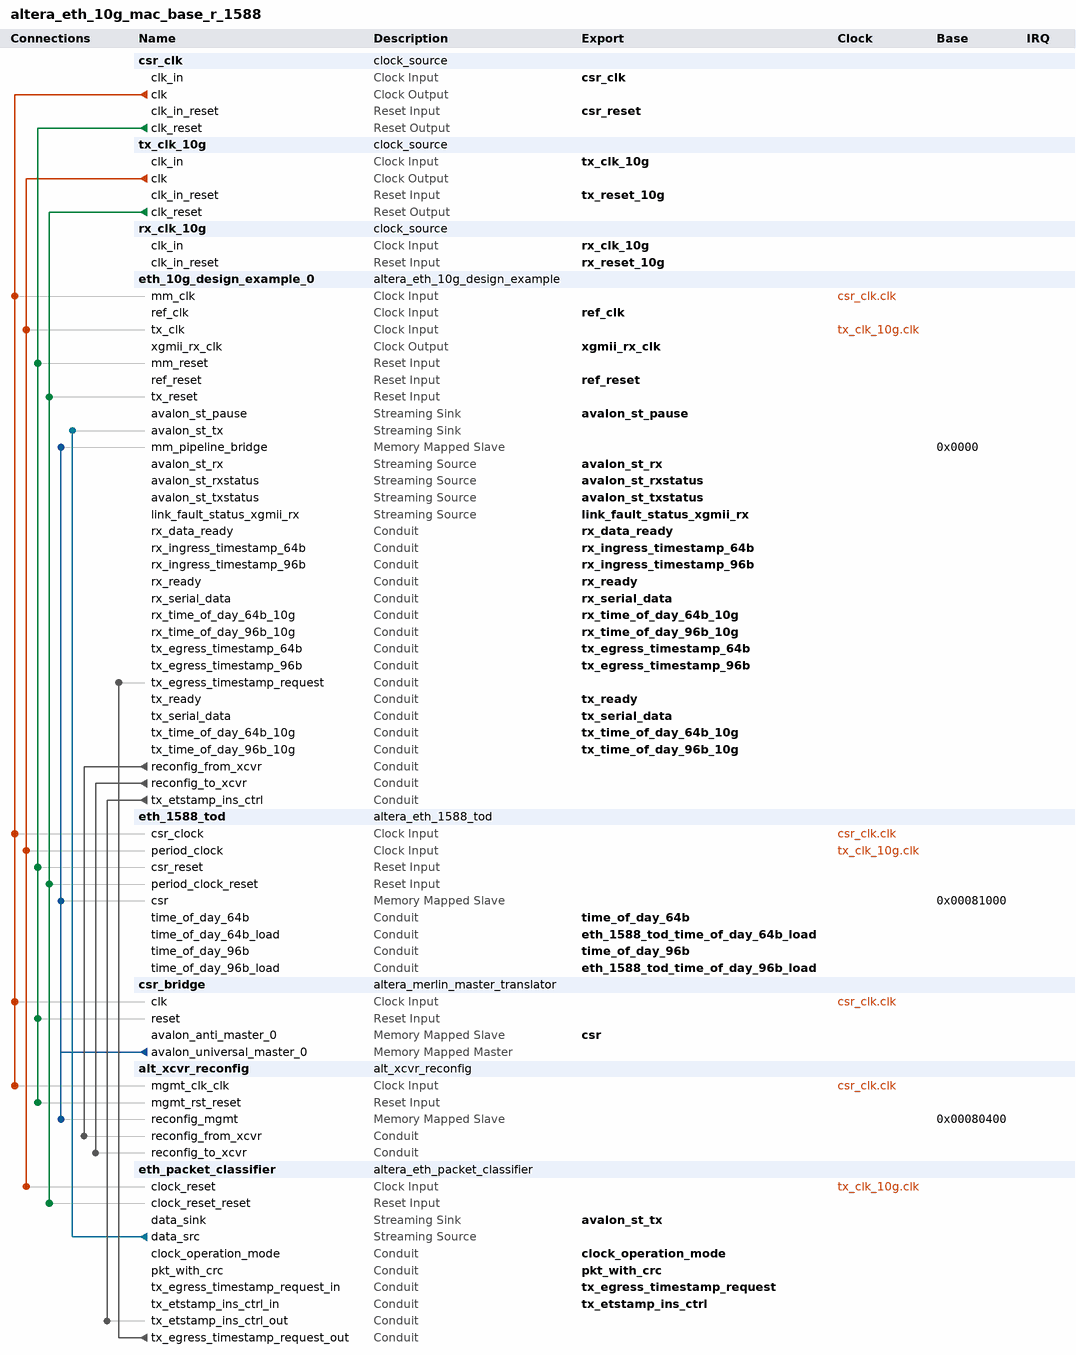
[diagram p0: system contents]
# Platform Designer (Qsys) system altera_eth_10g_mac_base_r_1588, Stratix V Unknown
# Parameters at their usual value, and those the tool derives, are not listed.
package require -exact qsys 13.0
create_system altera_eth_10g_mac_base_r_1588
set_project_property DEVICE_FAMILY {Stratix V}
set_project_property DEVICE Unknown

add_instance csr_clk clock_source 13.0
set_instance_parameter_value csr_clk clockFrequency 50000000

add_instance tx_clk_10g clock_source 13.0
set_instance_parameter_value tx_clk_10g clockFrequency 50000000

add_instance rx_clk_10g clock_source 13.0
set_instance_parameter_value rx_clk_10g clockFrequency 50000000

add_instance eth_10g_design_example_0 altera_eth_10g_design_example 13.0
set_instance_parameter_value eth_10g_design_example_0 DEVICE_FAMILY_TOP {Stratix V}
set_instance_parameter_value eth_10g_design_example_0 ENABLE_MAC_LOOPBACK {10Gbps Ethernet MAC with LoopBack Enabled}
set_instance_parameter_value eth_10g_design_example_0 CHOOSE_MDIO_2_WIRE_SERIAL_INT 1
set_instance_parameter_value eth_10g_design_example_0 PHY_IP 1
set_instance_parameter_value eth_10g_design_example_0 CHOOSE_FIFO 3
set_instance_parameter_value eth_10g_design_example_0 ENABLE_TIMESTAMPING 1
set_instance_parameter_value eth_10g_design_example_0 ENABLE_PTP_1STEP 1
set_instance_parameter_value eth_10g_design_example_0 TSTAMP_FP_WIDTH 4
set_instance_parameter_value eth_10g_design_example_0 PREAMBLE_PASSTHROUGH 0
set_instance_parameter_value eth_10g_design_example_0 ENABLE_PFC 0
set_instance_parameter_value eth_10g_design_example_0 PFC_PRIORITY_NUM 8
set_instance_parameter_value eth_10g_design_example_0 DATAPATH_OPTION 3
set_instance_parameter_value eth_10g_design_example_0 ENABLE_SUPP_ADDR 1
set_instance_parameter_value eth_10g_design_example_0 INSTANTIATE_TX_CRC 1
set_instance_parameter_value eth_10g_design_example_0 INSTANTIATE_STATISTICS 1
set_instance_parameter_value eth_10g_design_example_0 REGISTER_BASED_STATISTICS 0
set_instance_parameter_value eth_10g_design_example_0 ENABLE_1G10G_MAC 0
set_instance_parameter_value eth_10g_design_example_0 MDIO_MDC_DIVISOR 32
set_instance_parameter_value eth_10g_design_example_0 SYNC_TX_FIFO_SYMBOLS_PER_BEAT 8
set_instance_parameter_value eth_10g_design_example_0 SYNC_TX_FIFO_BITS_PER_SYMBOL 8
set_instance_parameter_value eth_10g_design_example_0 SYNC_TX_FIFO_DEPTH 512
set_instance_parameter_value eth_10g_design_example_0 SYNC_TX_FIFO_ERROR_WIDTH 1
set_instance_parameter_value eth_10g_design_example_0 SYNC_TX_USE_PACKETS 1
set_instance_parameter_value eth_10g_design_example_0 SYNC_TX_USE_FILL 1
set_instance_parameter_value eth_10g_design_example_0 SYNC_TX_USE_STORE_AND_FORWARD 1
set_instance_parameter_value eth_10g_design_example_0 SYNC_TX_USE_ALMOST_FULL 0
set_instance_parameter_value eth_10g_design_example_0 SYNC_TX_USE_ALMOST_EMPTY 0
set_instance_parameter_value eth_10g_design_example_0 SYNC_RX_FIFO_SYMBOLS_PER_BEAT 8
set_instance_parameter_value eth_10g_design_example_0 SYNC_RX_FIFO_BITS_PER_SYMBOL 8
set_instance_parameter_value eth_10g_design_example_0 SYNC_RX_FIFO_DEPTH 512
set_instance_parameter_value eth_10g_design_example_0 SYNC_RX_FIFO_ERROR_WIDTH 6
set_instance_parameter_value eth_10g_design_example_0 SYNC_RX_USE_PACKETS 1
set_instance_parameter_value eth_10g_design_example_0 SYNC_RX_USE_FILL 1
set_instance_parameter_value eth_10g_design_example_0 SYNC_RX_USE_STORE_AND_FORWARD 1
set_instance_parameter_value eth_10g_design_example_0 SYNC_RX_USE_ALMOST_FULL 1
set_instance_parameter_value eth_10g_design_example_0 SYNC_RX_USE_ALMOST_EMPTY 1
set_instance_parameter_value eth_10g_design_example_0 ASYNC_TX_FIFO_SYMBOLS_PER_BEAT 8
set_instance_parameter_value eth_10g_design_example_0 ASYNC_TX_FIFO_BITS_PER_SYMBOL 8
set_instance_parameter_value eth_10g_design_example_0 ASYNC_TX_FIFO_DEPTH 16
set_instance_parameter_value eth_10g_design_example_0 ASYNC_TX_FIFO_ERROR_WIDTH 1
set_instance_parameter_value eth_10g_design_example_0 ASYNC_TX_USE_PKT 1
set_instance_parameter_value eth_10g_design_example_0 ASYNC_TX_USE_SINK_FILL 0
set_instance_parameter_value eth_10g_design_example_0 ASYNC_TX_USE_SRC_FILL 0
set_instance_parameter_value eth_10g_design_example_0 ASYNC_RX_FIFO_SYMBOLS_PER_BEAT 8
set_instance_parameter_value eth_10g_design_example_0 ASYNC_RX_FIFO_BITS_PER_SYMBOL 8
set_instance_parameter_value eth_10g_design_example_0 ASYNC_RX_FIFO_DEPTH 16
set_instance_parameter_value eth_10g_design_example_0 ASYNC_RX_FIFO_ERROR_WIDTH 6
set_instance_parameter_value eth_10g_design_example_0 ASYNC_RX_USE_PKT 1
set_instance_parameter_value eth_10g_design_example_0 ASYNC_RX_USE_SINK_FILL 0
set_instance_parameter_value eth_10g_design_example_0 ASYNC_RX_USE_SRC_FILL 0
set_instance_parameter_value eth_10g_design_example_0 BASER_INTERFACE 0
set_instance_parameter_value eth_10g_design_example_0 BASER_PLL_TYPE CMU
set_instance_parameter_value eth_10g_design_example_0 BASER_STARTING_CHANNEL_NUMBER 0
set_instance_parameter_value eth_10g_design_example_0 BASER_REF_CLK_FREQ {644.53125 MHz}
set_instance_parameter_value eth_10g_design_example_0 BASER_TRANSMITTER_TERMINATION OCT_100_OHMS
set_instance_parameter_value eth_10g_design_example_0 BASER_PRE_EMPHASIS_PRE_TAP 0
set_instance_parameter_value eth_10g_design_example_0 BASER_PRE_EMPHASIS_PRE_TAP_POLARITY 0
set_instance_parameter_value eth_10g_design_example_0 BASER_PRE_EMPHASIS_FIRST_POST_TAP 5
set_instance_parameter_value eth_10g_design_example_0 BASER_PRE_EMPHASIS_SECOND_POST_TAP 0
set_instance_parameter_value eth_10g_design_example_0 BASER_PRE_EMPHASIS_SECOND_POST_TAP_POLARITY 0
set_instance_parameter_value eth_10g_design_example_0 BASER_TRANSMITTER_VOD 1
set_instance_parameter_value eth_10g_design_example_0 BASER_RECEIVER_TERMINATION OCT_100_OHMS
set_instance_parameter_value eth_10g_design_example_0 BASER_RECEIVER_DC_GAIN 0
set_instance_parameter_value eth_10g_design_example_0 BASER_RECEIVER_STATIC_EQUALIZER 14
set_instance_parameter_value eth_10g_design_example_0 BASER_EXT_PMA_CONTROL_CONF 0
set_instance_parameter_value eth_10g_design_example_0 BASER_ENA_ADD_CONTROL_STAT 0
set_instance_parameter_value eth_10g_design_example_0 BASER_RECOVERED_CLK_OUT 0
set_instance_parameter_value eth_10g_design_example_0 XAUI_STARTING_CHANNEL_NUMBER 0
set_instance_parameter_value eth_10g_design_example_0 starting_channel_number 0
set_instance_parameter_value eth_10g_design_example_0 interface_type {Soft XAUI}
set_instance_parameter_value eth_10g_design_example_0 soft_xaui_cfg {Only Soft XAUI is supported for this device.}
set_instance_parameter_value eth_10g_design_example_0 hard_xaui_cfg {Only Hard XAUI is supported for this device.}
set_instance_parameter_value eth_10g_design_example_0 gui_pll_type CMU
set_instance_parameter_value eth_10g_design_example_0 use_control_and_status_ports 0
set_instance_parameter_value eth_10g_design_example_0 external_pma_ctrl_reconf 0
set_instance_parameter_value eth_10g_design_example_0 recovered_clk_out 0
set_instance_parameter_value eth_10g_design_example_0 number_of_interfaces 1
set_instance_parameter_value eth_10g_design_example_0 use_rx_rate_match 0
set_instance_parameter_value eth_10g_design_example_0 tx_termination OCT_100_OHMS
set_instance_parameter_value eth_10g_design_example_0 tx_vod_selection 4
set_instance_parameter_value eth_10g_design_example_0 tx_preemp_pretap 0
set_instance_parameter_value eth_10g_design_example_0 tx_preemp_pretap_inv false
set_instance_parameter_value eth_10g_design_example_0 tx_preemp_tap_1 0
set_instance_parameter_value eth_10g_design_example_0 tx_preemp_tap_2 0
set_instance_parameter_value eth_10g_design_example_0 tx_preemp_tap_2_inv false
set_instance_parameter_value eth_10g_design_example_0 rx_common_mode 0.82v
set_instance_parameter_value eth_10g_design_example_0 rx_termination OCT_100_OHMS
set_instance_parameter_value eth_10g_design_example_0 rx_eq_dc_gain 0
set_instance_parameter_value eth_10g_design_example_0 rx_eq_ctrl 0

add_instance eth_1588_tod altera_eth_1588_tod 13.0
set_instance_parameter_value eth_1588_tod DEFAULT_NSEC_PERIOD 6
set_instance_parameter_value eth_1588_tod DEFAULT_FNSEC_PERIOD 26214
set_instance_parameter_value eth_1588_tod DEFAULT_NSEC_ADJPERIOD 6
set_instance_parameter_value eth_1588_tod DEFAULT_FNSEC_ADJPERIOD 26214

add_instance csr_bridge altera_merlin_master_translator 13.0
set_instance_parameter_value csr_bridge AV_ADDRESS_W 32
set_instance_parameter_value csr_bridge AV_DATA_W 32
set_instance_parameter_value csr_bridge AV_BURSTCOUNT_W 3
set_instance_parameter_value csr_bridge AV_BYTEENABLE_W 4
set_instance_parameter_value csr_bridge UAV_ADDRESS_W 32
set_instance_parameter_value csr_bridge UAV_BURSTCOUNT_W 3
set_instance_parameter_value csr_bridge AV_READLATENCY 0
set_instance_parameter_value csr_bridge AV_WRITE_WAIT 0
set_instance_parameter_value csr_bridge AV_READ_WAIT 0
set_instance_parameter_value csr_bridge AV_DATA_HOLD 0
set_instance_parameter_value csr_bridge AV_SETUP_WAIT 0
set_instance_parameter_value csr_bridge USE_READDATA 1
set_instance_parameter_value csr_bridge USE_WRITEDATA 1
set_instance_parameter_value csr_bridge USE_READ 1
set_instance_parameter_value csr_bridge USE_WRITE 1
set_instance_parameter_value csr_bridge USE_BEGINBURSTTRANSFER 0
set_instance_parameter_value csr_bridge USE_BEGINTRANSFER 0
set_instance_parameter_value csr_bridge USE_BYTEENABLE 0
set_instance_parameter_value csr_bridge USE_CHIPSELECT 0
set_instance_parameter_value csr_bridge USE_ADDRESS 1
set_instance_parameter_value csr_bridge USE_BURSTCOUNT 0
set_instance_parameter_value csr_bridge USE_DEBUGACCESS 0
set_instance_parameter_value csr_bridge USE_CLKEN 0
set_instance_parameter_value csr_bridge USE_READDATAVALID 0
set_instance_parameter_value csr_bridge USE_WAITREQUEST 1
set_instance_parameter_value csr_bridge USE_LOCK 0
set_instance_parameter_value csr_bridge USE_READRESPONSE 0
set_instance_parameter_value csr_bridge USE_WRITERESPONSE 0
set_instance_parameter_value csr_bridge AV_SYMBOLS_PER_WORD 4
set_instance_parameter_value csr_bridge AV_ADDRESS_SYMBOLS 1
set_instance_parameter_value csr_bridge AV_BURSTCOUNT_SYMBOLS 1
set_instance_parameter_value csr_bridge AV_CONSTANT_BURST_BEHAVIOR 0
set_instance_parameter_value csr_bridge UAV_CONSTANT_BURST_BEHAVIOR 0
set_instance_parameter_value csr_bridge AV_LINEWRAPBURSTS 0
set_instance_parameter_value csr_bridge AV_MAX_PENDING_READ_TRANSACTIONS 0
set_instance_parameter_value csr_bridge AV_BURSTBOUNDARIES 0
set_instance_parameter_value csr_bridge AV_INTERLEAVEBURSTS 0
set_instance_parameter_value csr_bridge AV_BITS_PER_SYMBOL 8
set_instance_parameter_value csr_bridge AV_ISBIGENDIAN 0
set_instance_parameter_value csr_bridge AV_ADDRESSGROUP 0
set_instance_parameter_value csr_bridge UAV_ADDRESSGROUP 0
set_instance_parameter_value csr_bridge AV_REGISTEROUTGOINGSIGNALS 0
set_instance_parameter_value csr_bridge AV_REGISTERINCOMINGSIGNALS 0
set_instance_parameter_value csr_bridge AV_ALWAYSBURSTMAXBURST 0

add_instance alt_xcvr_reconfig alt_xcvr_reconfig 13.0
set_instance_parameter_value alt_xcvr_reconfig device_family {Stratix V}
set_instance_parameter_value alt_xcvr_reconfig number_of_reconfig_interfaces 2
set_instance_parameter_value alt_xcvr_reconfig enable_analog 1
set_instance_parameter_value alt_xcvr_reconfig enable_adce 0

add_instance eth_packet_classifier altera_eth_packet_classifier 13.0
set_instance_parameter_value eth_packet_classifier TSTAMP_FP_WIDTH 4
set_instance_parameter_value eth_packet_classifier SYMBOLSPERBEAT 8
set_instance_parameter_value eth_packet_classifier BITSPERSYMBOL 8

# connections
add_connection csr_clk.clk alt_xcvr_reconfig.mgmt_clk_clk clock
add_connection csr_clk.clk csr_bridge.clk clock
add_connection csr_clk.clk eth_10g_design_example_0.mm_clk clock
add_connection csr_clk.clk eth_1588_tod.csr_clock clock
add_connection tx_clk_10g.clk eth_10g_design_example_0.tx_clk clock
add_connection tx_clk_10g.clk eth_1588_tod.period_clock clock
add_connection tx_clk_10g.clk eth_packet_classifier.clock_reset clock
add_connection csr_clk.clk_reset alt_xcvr_reconfig.mgmt_rst_reset reset
add_connection csr_clk.clk_reset csr_bridge.reset reset
add_connection csr_clk.clk_reset eth_10g_design_example_0.mm_reset reset
add_connection csr_clk.clk_reset eth_1588_tod.csr_reset reset
add_connection tx_clk_10g.clk_reset eth_10g_design_example_0.tx_reset reset
add_connection tx_clk_10g.clk_reset eth_1588_tod.period_clock_reset reset
add_connection tx_clk_10g.clk_reset eth_packet_classifier.clock_reset_reset reset
add_connection csr_bridge.avalon_universal_master_0 alt_xcvr_reconfig.reconfig_mgmt avalon
set_connection_parameter_value csr_bridge.avalon_universal_master_0/alt_xcvr_reconfig.reconfig_mgmt baseAddress 0x00080400
add_connection csr_bridge.avalon_universal_master_0 eth_10g_design_example_0.mm_pipeline_bridge avalon
set_connection_parameter_value csr_bridge.avalon_universal_master_0/eth_10g_design_example_0.mm_pipeline_bridge baseAddress 0x0000
add_connection csr_bridge.avalon_universal_master_0 eth_1588_tod.csr avalon
set_connection_parameter_value csr_bridge.avalon_universal_master_0/eth_1588_tod.csr baseAddress 0x00081000
add_connection eth_packet_classifier.data_src eth_10g_design_example_0.avalon_st_tx avalon_streaming
add_connection eth_10g_design_example_0.reconfig_from_xcvr alt_xcvr_reconfig.reconfig_from_xcvr conduit
add_connection eth_10g_design_example_0.reconfig_to_xcvr alt_xcvr_reconfig.reconfig_to_xcvr conduit
add_connection eth_10g_design_example_0.tx_etstamp_ins_ctrl eth_packet_classifier.tx_etstamp_ins_ctrl_out conduit
add_connection eth_packet_classifier.tx_egress_timestamp_request_out eth_10g_design_example_0.tx_egress_timestamp_request conduit

# exported interfaces
add_interface ref_clk clock sink
set_interface_property ref_clk EXPORT_OF eth_10g_design_example_0.ref_clk
add_interface ref_reset reset sink
set_interface_property ref_reset EXPORT_OF eth_10g_design_example_0.ref_reset
add_interface avalon_st_rxstatus avalon_streaming source
set_interface_property avalon_st_rxstatus EXPORT_OF eth_10g_design_example_0.avalon_st_rxstatus
add_interface link_fault_status_xgmii_rx avalon_streaming source
set_interface_property link_fault_status_xgmii_rx EXPORT_OF eth_10g_design_example_0.link_fault_status_xgmii_rx
add_interface rx_serial_data conduit end
set_interface_property rx_serial_data EXPORT_OF eth_10g_design_example_0.rx_serial_data
add_interface tx_serial_data conduit end
set_interface_property tx_serial_data EXPORT_OF eth_10g_design_example_0.tx_serial_data
add_interface rx_ready conduit end
set_interface_property rx_ready EXPORT_OF eth_10g_design_example_0.rx_ready
add_interface tx_ready conduit end
set_interface_property tx_ready EXPORT_OF eth_10g_design_example_0.tx_ready
add_interface avalon_st_pause avalon_streaming sink
set_interface_property avalon_st_pause EXPORT_OF eth_10g_design_example_0.avalon_st_pause
add_interface avalon_st_txstatus avalon_streaming source
set_interface_property avalon_st_txstatus EXPORT_OF eth_10g_design_example_0.avalon_st_txstatus
add_interface csr avalon slave
set_interface_property csr EXPORT_OF csr_bridge.avalon_anti_master_0
add_interface tx_clk_10g clock sink
set_interface_property tx_clk_10g EXPORT_OF tx_clk_10g.clk_in
add_interface tx_reset_10g reset sink
set_interface_property tx_reset_10g EXPORT_OF tx_clk_10g.clk_in_reset
add_interface xgmii_rx_clk clock source
set_interface_property xgmii_rx_clk EXPORT_OF eth_10g_design_example_0.xgmii_rx_clk
add_interface rx_data_ready conduit end
set_interface_property rx_data_ready EXPORT_OF eth_10g_design_example_0.rx_data_ready
add_interface tx_egress_timestamp_96b conduit end
set_interface_property tx_egress_timestamp_96b EXPORT_OF eth_10g_design_example_0.tx_egress_timestamp_96b
add_interface tx_egress_timestamp_64b conduit end
set_interface_property tx_egress_timestamp_64b EXPORT_OF eth_10g_design_example_0.tx_egress_timestamp_64b
add_interface rx_ingress_timestamp_96b conduit end
set_interface_property rx_ingress_timestamp_96b EXPORT_OF eth_10g_design_example_0.rx_ingress_timestamp_96b
add_interface rx_ingress_timestamp_64b conduit end
set_interface_property rx_ingress_timestamp_64b EXPORT_OF eth_10g_design_example_0.rx_ingress_timestamp_64b
add_interface csr_clk clock sink
set_interface_property csr_clk EXPORT_OF csr_clk.clk_in
add_interface csr_reset reset sink
set_interface_property csr_reset EXPORT_OF csr_clk.clk_in_reset
add_interface rx_clk_10g clock sink
set_interface_property rx_clk_10g EXPORT_OF rx_clk_10g.clk_in
add_interface rx_reset_10g reset sink
set_interface_property rx_reset_10g EXPORT_OF rx_clk_10g.clk_in_reset
add_interface avalon_st_tx avalon_streaming sink
set_interface_property avalon_st_tx EXPORT_OF eth_packet_classifier.data_sink
add_interface avalon_st_rx avalon_streaming source
set_interface_property avalon_st_rx EXPORT_OF eth_10g_design_example_0.avalon_st_rx
add_interface clock_operation_mode conduit end
set_interface_property clock_operation_mode EXPORT_OF eth_packet_classifier.clock_operation_mode
add_interface pkt_with_crc conduit end
set_interface_property pkt_with_crc EXPORT_OF eth_packet_classifier.pkt_with_crc
add_interface tx_egress_timestamp_request conduit end
set_interface_property tx_egress_timestamp_request EXPORT_OF eth_packet_classifier.tx_egress_timestamp_request_in
add_interface time_of_day_96b conduit end
set_interface_property time_of_day_96b EXPORT_OF eth_1588_tod.time_of_day_96b
add_interface time_of_day_64b conduit end
set_interface_property time_of_day_64b EXPORT_OF eth_1588_tod.time_of_day_64b
add_interface tx_time_of_day_96b_10g conduit end
set_interface_property tx_time_of_day_96b_10g EXPORT_OF eth_10g_design_example_0.tx_time_of_day_96b_10g
add_interface tx_time_of_day_64b_10g conduit end
set_interface_property tx_time_of_day_64b_10g EXPORT_OF eth_10g_design_example_0.tx_time_of_day_64b_10g
add_interface rx_time_of_day_96b_10g conduit end
set_interface_property rx_time_of_day_96b_10g EXPORT_OF eth_10g_design_example_0.rx_time_of_day_96b_10g
add_interface rx_time_of_day_64b_10g conduit end
set_interface_property rx_time_of_day_64b_10g EXPORT_OF eth_10g_design_example_0.rx_time_of_day_64b_10g
add_interface tx_etstamp_ins_ctrl conduit end
set_interface_property tx_etstamp_ins_ctrl EXPORT_OF eth_packet_classifier.tx_etstamp_ins_ctrl_in
add_interface eth_1588_tod_time_of_day_96b_load conduit end
set_interface_property eth_1588_tod_time_of_day_96b_load EXPORT_OF eth_1588_tod.time_of_day_96b_load
add_interface eth_1588_tod_time_of_day_64b_load conduit end
set_interface_property eth_1588_tod_time_of_day_64b_load EXPORT_OF eth_1588_tod.time_of_day_64b_load

set_interconnect_requirement {$system} qsys_mm.clockCrossingAdapter HANDSHAKE
set_interconnect_requirement {$system} qsys_mm.maxAdditionalLatency 1

save_system altera_eth_10g_mac_base_r_1588.qsys
